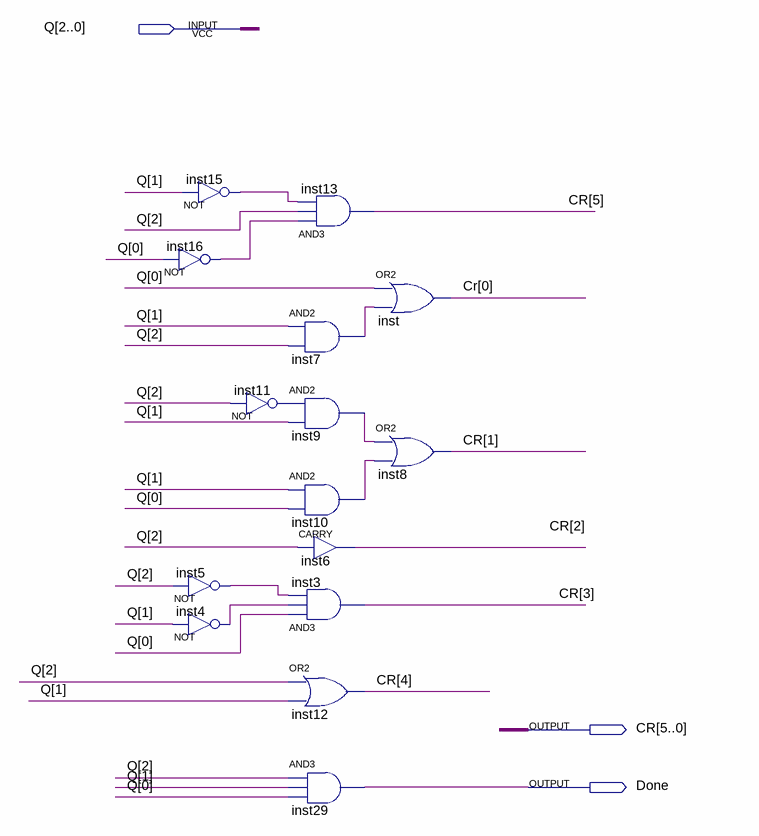
[diagram p0: schematic sheet]
// Quartus schematic Outputlogic_vesion2.bdf as structural Verilog: 15 symbols, 3 pins
module Outputlogic_vesion2 (
  input  [2:0] Q,
  output [5:0] CR,
  output Done
);

  wire inst4_out, inst5_out, inst7_out, inst9_out, inst10_out, inst11_out, inst15_out, inst16_out;

  not inst15 (inst15_out, Q[1]);
  not inst16 (inst16_out, Q[0]);
  not inst11 (inst11_out, Q[2]);
  not inst5 (inst5_out, Q[2]);
  not inst4 (inst4_out, Q[1]);
  and inst13 (CR[5], inst16_out, Q[2], inst15_out);
  and inst7 (inst7_out, Q[1], Q[2]);
  and inst9 (inst9_out, inst11_out, Q[1]);
  and inst10 (inst10_out, Q[1], Q[0]);
  CARRY inst6 (.IN(Q[2]), .OUT(CR[2]));
  and inst3 (CR[3], Q[0], inst4_out, inst5_out);
  or inst12 (CR[4], Q[2], Q[1]);
  and inst29 (Done, Q[2], Q[1], Q[0]);
  or inst (CR[0], Q[0], inst7_out);
  or inst8 (CR[1], inst9_out, inst10_out);
endmodule
